# Altium schematic sheet Main.SchDoc
size A3; SheetNumber: 1
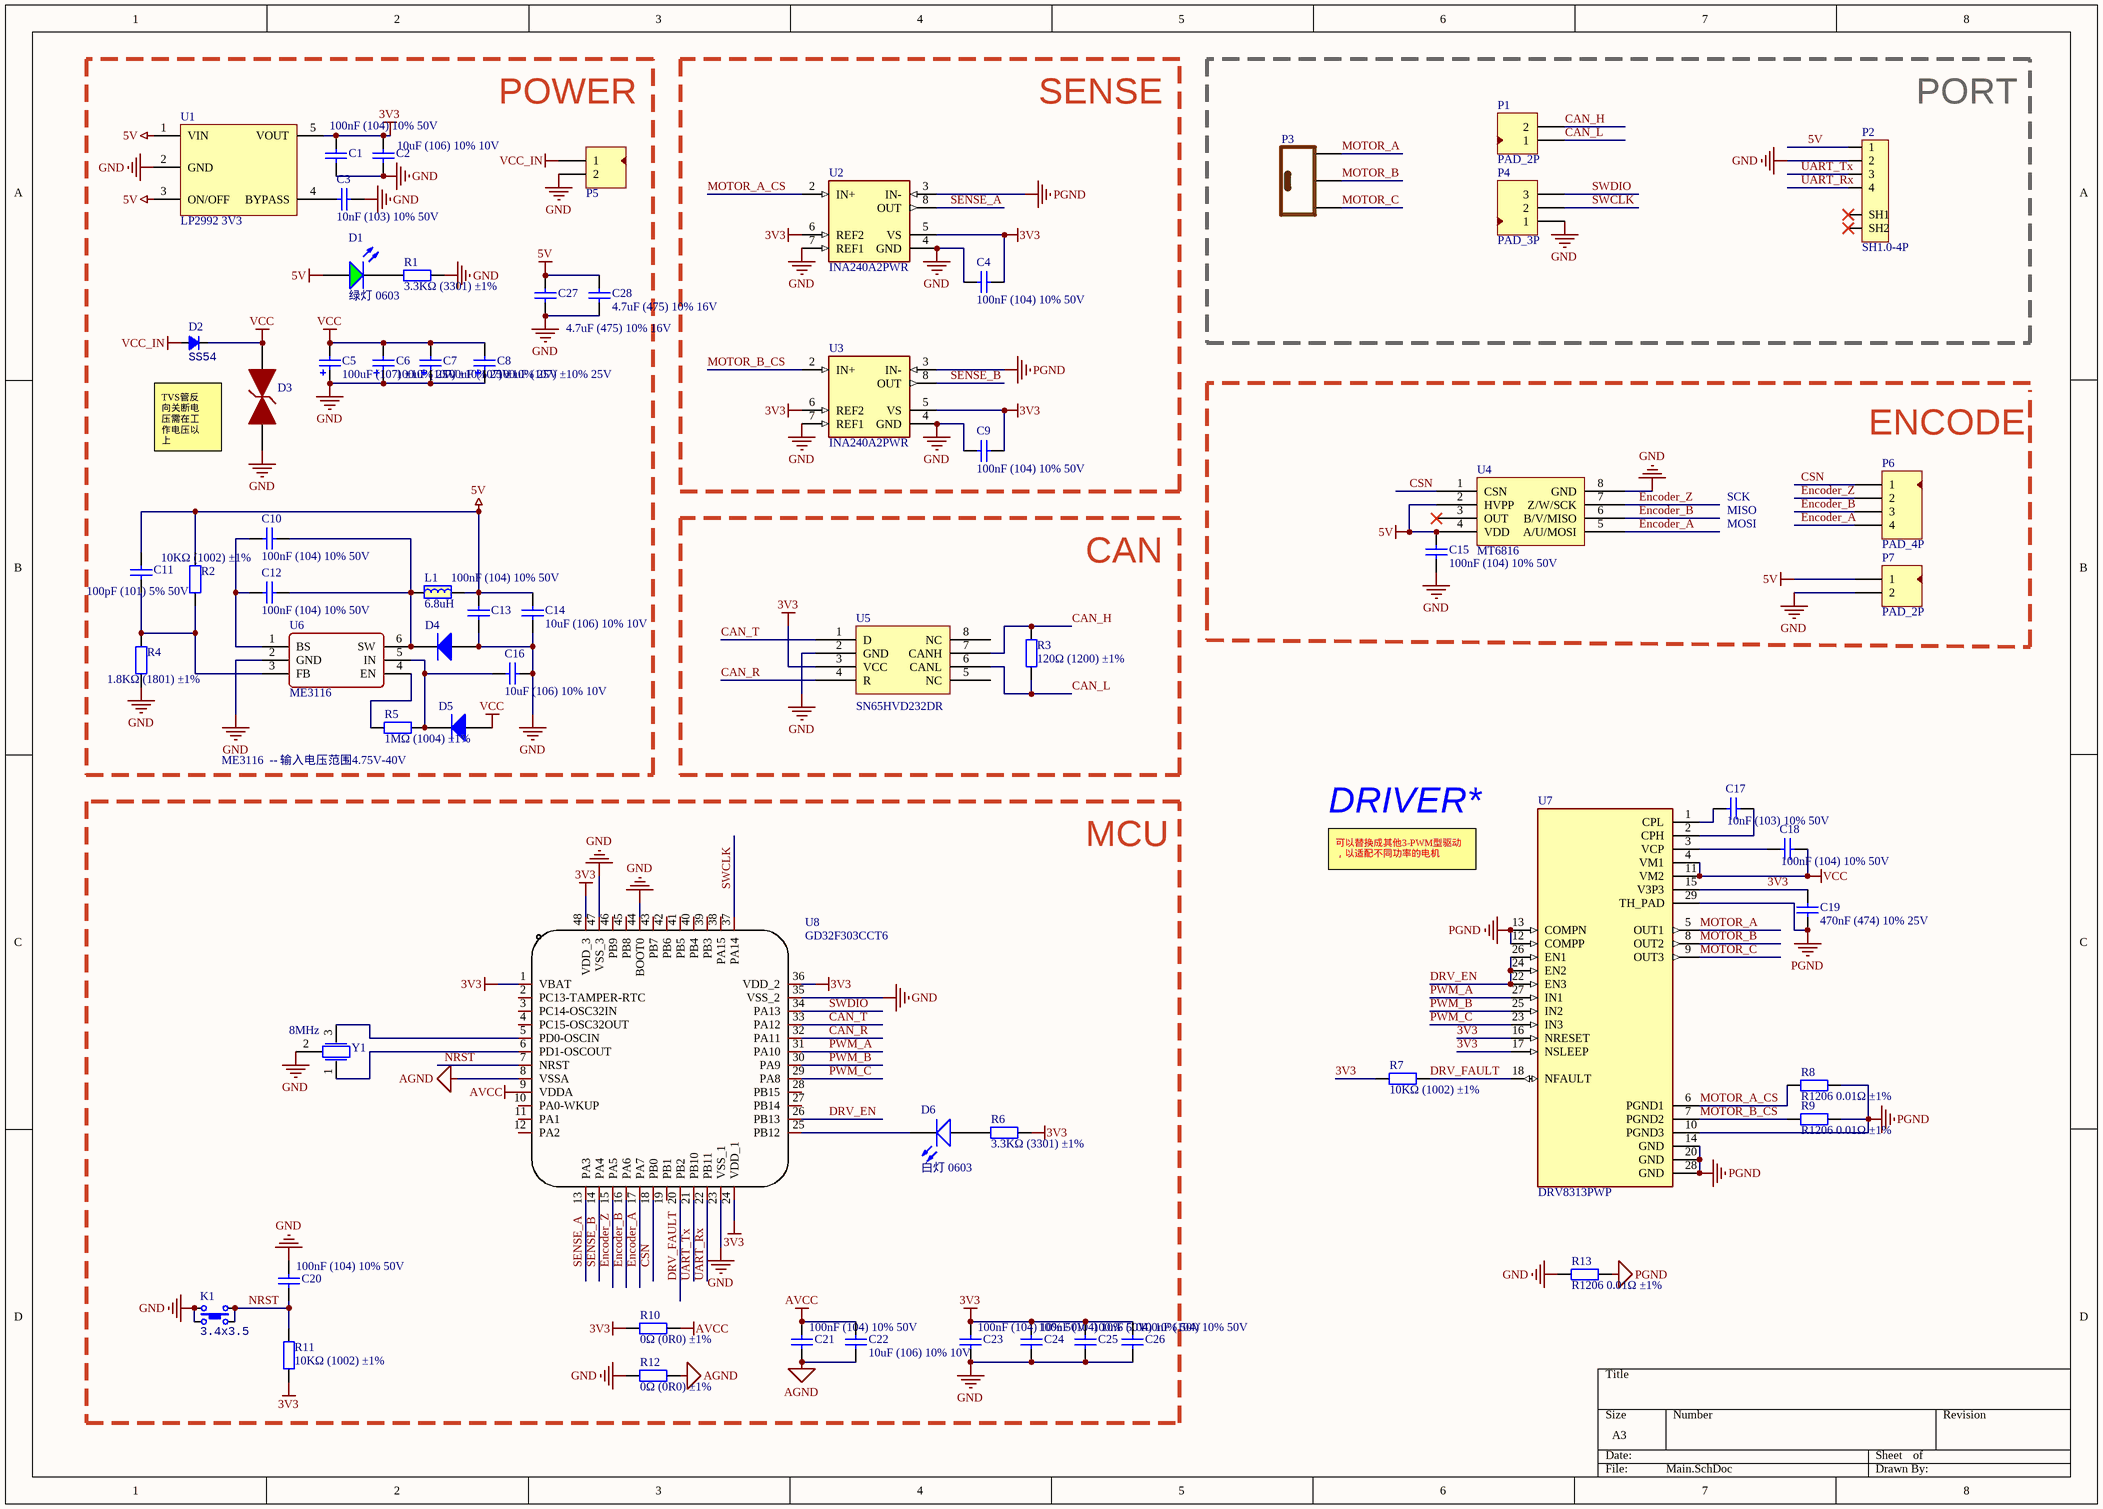
[diagram p0: Main.SchDoc]

## Parts
C1  100nF (104) 10% 50V  [0603_C]
C2  10uF (106) 10% 10V  [0603_C]
C3  10nF (103) 10% 50V  [0603_C]
C4  100nF (104) 10% 50V  [0603_C]
C5  100uF (107) ±10% 25V  [CASE-B_3528]
C6  100uF (107) ±10% 25V  [CASE-B_3528]
C7  100uF (107) ±10% 25V  [CASE-B_3528]
C8  100uF (107) ±10% 25V  [CASE-B_3528]
C9  100nF (104) 10% 50V  [0603_C]
C10  100nF (104) 10% 50V  [0603_C]
C11  100pF (101) 5% 50V  [0603_C]
C12  100nF (104) 10% 50V  [0603_C]
C13  100nF (104) 10% 50V  [0603_C]
C14  10uF (106) 10% 10V  [0603_C]
C15  100nF (104) 10% 50V  [0603_C]
C16  10uF (106) 10% 10V  [0603_C]
C17  10nF (103) 10% 50V  [0603_C]
C18  100nF (104) 10% 50V  [0603_C]
C19  470nF (474) 10% 25V  [0603_C]
C20  100nF (104) 10% 50V  [0603_C]
C21  100nF (104) 10% 50V  [0603_C]
C22  10uF (106) 10% 10V  [0603_C]
C23  100nF (104) 10% 50V  [0603_C]
C24  100nF (104) 10% 50V  [0603_C]
C25  100nF (104) 10% 50V  [0603_C]
C26  100nF (104) 10% 50V  [0603_C]
C27  4.7uF (475) 10% 16V  [0603_C]
C28  4.7uF (475) 10% 16V  [0603_C]
D1  绿灯 0603  [0603_LED_S1]
D2  SS54  [DO-214AC]
D3  SMBJ28CA  [SMBJ-CA_MFG]  (value not drawn)
D4  二极管-5B5819WS  [SOD-323]  (value not drawn)
D5  二极管-5B5819WS  [SOD-323]  (value not drawn)
D6  白灯 0603  [0603_LED_S1]
K1  value 3.4x3.5  [ButtonTACT_3.5*3.55_90]  (hidden comment: TACT 4P)
L1  6.8uH  [IND-201612]
P1  PAD_2P  [接线焊接点_2P]
P2  SH1.0-4P  [XP4]
P3  电机接插件-3P  [AMASS-MR30-M]  (value not drawn)
P4  PAD_3P  [接线焊接点_3P]
P5  Header 2  [HDR1X2]  (value not drawn)
P6  PAD_4P  [接线焊接点_4P]
P7  PAD_2P  [接线焊接点_2P]
R1  3.3KΩ (3301) ±1%  [0603_R]
R2  10KΩ (1002) ±1%  [0603_R]
R3  120Ω (1200) ±1%  [0603_R]
R4  1.8KΩ (1801) ±1%  [0603_R]
R5  1MΩ (1004) ±1%  [0603_R]
R6  3.3KΩ (3301) ±1%  [0603_R]
R7  10KΩ (1002) ±1%  [0603_R]
R8  R1206 0.01Ω ±1%  [1206_R]
R9  R1206 0.01Ω ±1%  [1206_R]
R10  0Ω (0R0) ±1%  [0603_R]
R11  10KΩ (1002) ±1%  [0603_R]
R12  0Ω (0R0) ±1%  [0603_R]
R13  R1206 0.01Ω ±1%  [1206_R]
U1  LP2992 3V3  [SOT23-5]
U2  INA240A2PWR  [SOP65 P640X120-8N]
U3  INA240A2PWR  [SOP65 P640X120-8N]
U4  MT6816  [SOP8-PP-AT8870]
U5  Manufacturer Part Number: SN65HVD232DR  [SO-8]  (hidden comment: SN65HVD232D)
U6  ME3116  [SOT23-6]
U7  DRV8313PWP  [HTSSOP-28]
U8  GD32F303CCT6  [LQFP_48]
Y1  8MHz  [晶振-3P]

## Blocks framed on the sheet
POWER: C1-C3 C5-C8 C10-C14 C16 C27 C28 D1-D5 L1 P5 R1 R2 R4 R5 U1 U6
SENSE: C4 C9 U2 U3
PORT: P1-P4
CAN: R3 U5
MCU: C20-C26 D6 K1 R6 R10-R12 U8 Y1

## Nets
3V3: C1.2 C2.2 C4.2 C9.1 C19.2 C23.2 C24.2 C25.2 C26.2 R6.2 R7.1 R10.1 R11.1 U1.5(VOUT) U2.5(VS) U2.6(REF2) U3.5(VS) U3.6(REF2) U5.3(VCC) U7.15(V3P3) U7.16(NRESET) U7.17(NSLEEP) U8.1(VBAT) U8.24(VDD_1) U8.36(VDD_2) U8.48(VDD_3)
5V: C11.2 C13.2 C14.2 C15.2 C27.2 C28.2 D1.A L1.2 P2.1 P7.1 R2.2 U1.1(VIN) U1.3(ON/OFF) U4.2(HVPP) U4.4(VDD)
AGND: C21.1 C22.1 R12.2 U8.8(VSSA)
AVCC: C21.2 C22.2 R10.2 U8.9(VDDA)
GND: C1.1 C2.1 C3.2 C4.1 C5.1 C6.1 C7.1 C8.1 C9.2 C13.1 C14.1 C15.1 C16.1 C20.2 C23.1 C24.1 C25.1 C26.1 C27.1 C28.1 D3.1 D4.1(A) K1.2 K1.4 P2.2 P4.1 P5.2 P7.2 R1.2 R4.1 R12.1 R13.1 U1.2(GND) U2.4(GND) U2.7(REF1) U3.4(GND) U3.7(REF1) U4.8(GND) U5.2(GND) U6.2(GND) U8.23(VSS_1) U8.35(VSS_2) U8.44(BOOT0) U8.47(VSS_3) Y1.2
PGND: C19.1 R8.2 R9.2 R13.2 U2.3(IN-) U3.3(IN-) U7.10(PGND3) U7.12(COMPP) U7.13(COMPN) U7.14(GND) U7.20(GND) U7.28(GND) U7.29(TH_PAD)
VCC: C5.2 C6.2 C7.2 C8.2 C18.1 D2.2(K) D3.2 D5.1(A) U7.4(VM1) U7.11(VM2)
VCC_IN: D2.1(A) P5.1
CAN_H: P1.2 R3.2 U5.7(CANH)
CAN_L: P1.1 R3.1 U5.6(CANL)
CAN_R: U5.4(R) U8.32(PA11)
CAN_T: U5.1(D) U8.33(PA12)
CSN: P6.1 U4.1(CSN) U8.18(PB0)
DRV_EN: U7.22(EN3) U7.24(EN2) U7.26(EN1) U8.26(PB13)
DRV_FAULT: R7.2 U7.18(NFAULT) U8.20(PB2)
Encoder_A: P6.4 U4.5(A/U/MOSI) U8.17(PA7)
Encoder_B: P6.3 U4.6(B/V/MISO) U8.16(PA6)
Encoder_Z: P6.2 U4.7(Z/W/SCK) U8.15(PA5)
MOTOR_A: P3.3 U7.5(OUT1)
MOTOR_A_CS: R8.1 U2.2(IN+) U7.6(PGND1)
MOTOR_B: P3.2 U7.8(OUT2)
MOTOR_B_CS: R9.1 U3.2(IN+) U7.7(PGND2)
MOTOR_C: P3.1 U7.9(OUT3)
NRST: C20.1 K1.1 K1.3 R11.2 U8.7(NRST)
PWM_A: U7.27(IN1) U8.31(PA10)
PWM_B: U7.25(IN2) U8.30(PA9)
PWM_C: U7.23(IN3) U8.29(PA8)
SENSE_A: U2.8(OUT) U8.13(PA3)
SENSE_B: U3.8(OUT) U8.14(PA4)
SWCLK: P4.2 U8.37(PA14)
SWDIO: P4.3 U8.34(PA13)
UART_Rx: P2.4 U8.22(PB11)
UART_Tx: P2.3 U8.21(PB10)
NetC3_1: C3.1 U1.4(BYPASS)
NetC10_1: C10.1 C12.1 D4.2(K) L1.1 U6.6(SW)
NetC10_2: C10.2 C12.2 U6.1(BS)
NetC11_1: C11.1 R2.1 R4.2 U6.3(FB)
NetC16_2: C16.2 D5.2(K) R5.2 U6.5(IN)
NetC17_1: C17.1 U7.1(CPL)
NetC17_2: C17.2 U7.2(CPH)
NetC18_2: C18.2 U7.3(VCP)
NetD1_K: D1.K R1.1
NetD6_A: D6.A R6.1
NetD6_K: D6.K U8.25(PB12)
NetR5_1: R5.1 U6.4(EN)
NetU8_5: U8.5(PD0-OSCIN) Y1.3
NetU8_6: U8.6(PD1-OSCOUT) Y1.1

Not connected (* = marked no-connect by the designer): P2 SH1* SH2*; U4 3(OUT)*; U5 5(NC) 8(NC); U8 2(PC13-TAMPER-RTC) 3(PC14-OSC32IN) 4(PC15-OSC32OUT) 10(PA0-WKUP) 11(PA1) 12(PA2) 19(PB1) 27(PB14) 28(PB15) 38(PA15) 39(PB3) 40(PB4) 41(PB5) 42(PB6) 43(PB7) 45(PB8) 46(PB9)

## Notes on the sheet
- TVS管反
  向关断电
  压需在工
  作电压以
  上
- (near P6) ENCODE
- SCK
- MISO
- MOSI
- (near R5) ME3116  -- 输入电压范围4.75V-40V
- DRIVER*
- 可以替换成其他3-PWM型驱动，以适配不同功率的电机

## Library data of the parts
C1 C4 C9 C10 C12 C13 C15 C18 C20 C21 C23-C26 = 0603 100nF (104) 10% 50V: 贴片电容; ComponentLink1Description: 供应商链接; ComponentLink1URL: http://www.szlcsc.com/product/details_15331.html; Package: 0603; Supplier: LC; SuppliersPartNumber: C14663
C2 C14 C16 C22 = 0603 10uF (106) 10% 10V: 贴片电容; ComponentLink1Description: 供应商链接; ComponentLink1URL: http://www.szlcsc.com/product/details_20411.html; Package: 0603; Supplier: LC; SuppliersPartNumber: C19702
C3 C17 = 0603 10nF (103) 10% 50V: 贴片电容; ComponentLink1Description: 供应商链接; ComponentLink1URL: http://www.szlcsc.com/product/details_58143.html; Package: 0603; Supplier: LC; SuppliersPartNumber: C57112
C5-C8 = 3528 100uF (107) 10% 25V: 钽电容; ComponentLink1Description: 供应商链接; ComponentLink1URL: http://www.szlcsc.com/product/details_16815.html; Package: 3528; Supplier: LC; SuppliersPartNumber: C16133
C11 = 0603 100pF (101) 5% 50V: 贴片电容; ComponentLink1Description: 供应商链接; ComponentLink1URL: http://www.szlcsc.com/product/details_15530.html; Package: 0603; Supplier: LC; SuppliersPartNumber: C14858
C19 = 0603 470nF (474) 10% 25V: 贴片电容; ComponentLink1Description: 供应商链接; ComponentLink1URL: http://www.szlcsc.com/product/details_1975.html; Package: 0603; Supplier: LC; SuppliersPartNumber: C1623
C27 C28 = 0603 4.7uF (475) 10% 16V: 贴片电容; ComponentLink1Description: 供应商链接; ComponentLink1URL: http://www.szlcsc.com/product/details_20375.html; Package: 0603; Supplier: LC; SuppliersPartNumber: C19666
D1 = 0603 绿灯: 发光二极管; ComponentLink1Description: 供应商链接; ComponentLink1URL: http://www.szlcsc.com/product/details_73152.html; Package: 0603; Supplier: LC; SuppliersPartNumber: C72043
D2 = Diode_SMA: Diode; Type: SMA; Value: SS54
D4 D5 = 二极管-5B5817WS: 40V
D6 = 0603 白灯: 发光二极管; ComponentLink1Description: 供应商链接; ComponentLink1URL: http://www.szlcsc.com/product/details_2663.html; Package: 0603; Supplier: LC; SuppliersPartNumber: C2290
K1 = ButtonTACT: Button; type: TACT 4P
L1 = 电感-201612
P1 P7 = PAD_2P: 导线焊接点
P3 = 电机接插件-3P: AMASS MR30
P4 = PAD_3P: 导线焊接点
P5 = Header 2: 接插件; LatestRevisionDate: 17-Jul-2002; LatestRevisionNote: Re-released for DXP Platform.; Publisher: Altium Limited
P6 = PAD_4P: 导线焊接点
R1 R6 = 0603 3.3KΩ (3301) 1%: 贴片电阻; ComponentLink1Description: 供应商链接; ComponentLink1URL: http://www.szlcsc.com/product/details_23705.html; Package: 0603; Supplier: LC; SuppliersPartNumber: C22978
R2 R7 R11 = 0603 10KΩ (1002) 1%: 贴片电阻; ComponentLink1Description: 供应商链接; ComponentLink1URL: http://www.szlcsc.com/product/details_26547.html; Package: 0603; Supplier: LC; SuppliersPartNumber: C25804
R3 = 0603 120Ω (1200) 1%: 贴片电阻; ComponentLink1Description: 供应商链接; ComponentLink1URL: http://www.szlcsc.com/product/details_23514.html; Package: 0603; Supplier: LC; SuppliersPartNumber: C22787
R4 = 0603 1.8KΩ (1801) 1%: 贴片电阻; ComponentLink1Description: 供应商链接; ComponentLink1URL: http://www.szlcsc.com/product/details_4584.html; Package: 0603; Supplier: LC; SuppliersPartNumber: C4177
R5 = 0603 1MΩ (1004) 1%: 贴片电阻; ComponentLink1Description: 供应商链接; ComponentLink1URL: http://www.szlcsc.com/product/details_23662.html; Package: 0603; Supplier: LC; SuppliersPartNumber: C22935
R8 R9 R13 = 1206 0.005Ω 1%: 电流检测电阻; ComponentLink1Description: 供应商链接; ComponentLink1URL: http://www.szlcsc.com/product/details_18673.html; Package: 1206; Supplier: LC; SuppliersPartNumber: C17985
R10 R12 = 0603 0Ω (0R0) 1%: 贴片电阻; ComponentLink1Description: 供应商链接; ComponentLink1URL: http://www.szlcsc.com/product/details_21903.html; Package: 0603; Supplier: LC; SuppliersPartNumber: C21189
U1 = LP2992: LDO
U2 U3 = INA240A2PWR: -4 to 80V, bidirectional, ultra-precise current sense amplifier with enhanced PWM rejection 8-TSSOP -40 to 125; MF: Texas Instruments; MP: INA240A2PWR; Value: *; Package: TSSOP-8 Texas Instruments; Price: None; Availability: Good; Purchase-URL: https://pricing.snapeda.com/search/part/INA240A2PWR/?ref=eda; SnapEDA_Link: https://www.snapeda.com/parts/INA240A2PWR/Texas%20Instruments/view-part/588604/?ref=snap
U5 = SN65HVD232D: Manufacturer: Texas Instruments; Protocol: CAN; Number of Drivers/Receivers: 1/1; Duplex: Half; Data Rate: 1Mbps; Voltage - Supply: 3 V ~ 3.6 V; Supplier 1: Digi-Key; Supplier Part Number 1: 296-26344-2-ND; RoHS: RoHS Compliant; Category: Integrated Circuits (ICs); Stock: 5000; Pricing 1: 2500=0.84375 (USD); Packaging: Tape & Reel (TR); Part Status: Active; Type: Transceiver; Operating Temperature: -40°C ~ 85°C; Mounting Type: Surface Mount; Package / Case: 8-SOIC (0.154", 3.90mm Width); Supplier Device Package: 8-SOIC; ComponentLink1URL: http://www.ti.com/lit/ds/symlink/sn65hvd230.pdf; ComponentLink1Description: http://www.ti.com/lit/ds/symlink/sn65hvd230.pdf; Supplier 2: Digi-Key; Supplier Part Number 2: 296-26344-1-ND; Pricing 2: 1=2.05, 10=1.842, 100=1.4809, 500=1.21668, 1000=1.00811 (USD)
U6 = ME3116: DC-DC
U7 = DRV8313PWP: 65-V max, 3-A peak 3-phase motor driver 28-HTSSOP -40 to 125; MF: Texas Instruments; Availability: Good; SnapEDA_Link: https://www.snapeda.com/parts/DRV8313PWP/Texas%20Instruments/view-part/287728/?ref=snap; Price: None; MP: DRV8313PWP; Purchase-URL: https://pricing.snapeda.com/search/part/DRV8313PWP/?ref=eda; Package: HTSSOP-28 Texas Instruments; Value: *
Y1 = 晶振-3Pin: 村田贴片